# EAGLE schematic norlogic (EAGLE 6.3)
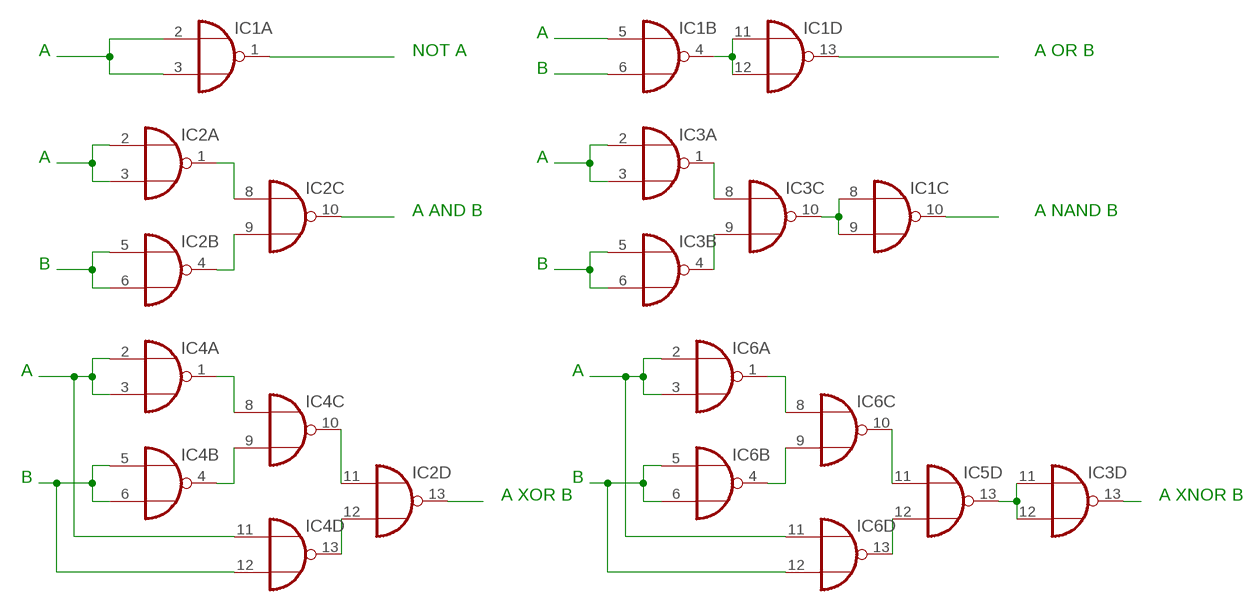
[diagram p0: schematic, sheet 1]

## Parts
IC1  74AC02N  [DIL14]
IC2  74AC02N  [DIL14]
IC3  74AC02N  [DIL14]
IC4  74AC02N  [DIL14]
IC5  74AC02N  [DIL14]
IC6  74AC02N  [DIL14]

## Nets
N$1: IC1.2(A:I0) IC1.3(A:I1)
N$2: IC1.1(A:O)
N$3: IC1.5(B:I0)
N$4: IC1.6(B:I1)
N$5: IC2.1(A:O) IC2.8(C:I0)
N$6: IC2.4(B:O) IC2.9(C:I1)
N$7: IC2.2(A:I0) IC2.3(A:I1)
N$8: IC2.5(B:I0) IC2.6(B:I1)
N$9: IC1.4(B:O) IC1.11(D:I0) IC1.12(D:I1)
N$10: IC1.13(D:O)
N$11: IC2.10(C:O)
N$12: IC3.1(A:O) IC3.8(C:I0)
N$13: IC3.4(B:O) IC3.9(C:I1)
N$14: IC3.2(A:I0) IC3.3(A:I1)
N$15: IC3.5(B:I0) IC3.6(B:I1)
N$16: IC1.8(C:I0) IC1.9(C:I1) IC3.10(C:O)
N$17: IC1.10(C:O)
N$18: IC4.1(A:O) IC4.8(C:I0)
N$19: IC4.4(B:O) IC4.9(C:I1)
N$20: IC4.2(A:I0) IC4.3(A:I1) IC4.11(D:I0)
N$21: IC4.5(B:I0) IC4.6(B:I1) IC4.12(D:I1)
N$22: IC2.11(D:I0) IC4.10(C:O)
N$23: IC2.12(D:I1) IC4.13(D:O)
N$24: IC2.13(D:O)
N$25: IC6.1(A:O) IC6.8(C:I0)
N$26: IC6.4(B:O) IC6.9(C:I1)
N$27: IC6.2(A:I0) IC6.3(A:I1) IC6.11(D:I0)
N$28: IC6.5(B:I0) IC6.6(B:I1) IC6.12(D:I1)
N$29: IC5.11(D:I0) IC6.10(C:O)
N$30: IC5.12(D:I1) IC6.13(D:O)
N$31: IC3.11(D:I0) IC3.12(D:I1) IC5.13(D:O)
Unconnected: IC3.13(D:O) IC5.1(A:O) IC5.2(A:I0) IC5.3(A:I1) IC5.4(B:O) IC5.5(B:I0) IC5.6(B:I1) IC5.8(C:I0) IC5.9(C:I1) IC5.10(C:O)

## Notes on the sheet
- A
- A | NOT A | A OR B
- B
- A | A
- A AND B | A NAND B
- B | B
- A | A
- B | B
- A XOR B | A XNOR B

## Power pins joined to a net without a drawn wire
GND: IC1.7(P:GND) IC2.7(P:GND) IC3.7(P:GND) IC4.7(P:GND) IC5.7(P:GND) IC6.7(P:GND)
VCC: IC1.14(P:VCC) IC2.14(P:VCC) IC3.14(P:VCC) IC4.14(P:VCC) IC5.14(P:VCC) IC6.14(P:VCC)

## Library data of the parts
IC1-IC6 = 74xx-eu:74*02: Quad 2-input NOR gate